# Altium schematic sheet BOC_KB.SchDoc: Board-On-Chip Keyboard
size A; Organization: Altium Limited; Address1: L3, 12a Rodborough Rd; Address2: Frenchs Forest; Address3: NSW; Address4: Australia 2086; Revision: 1.06; SheetNumber: 6; SheetTotal: 16
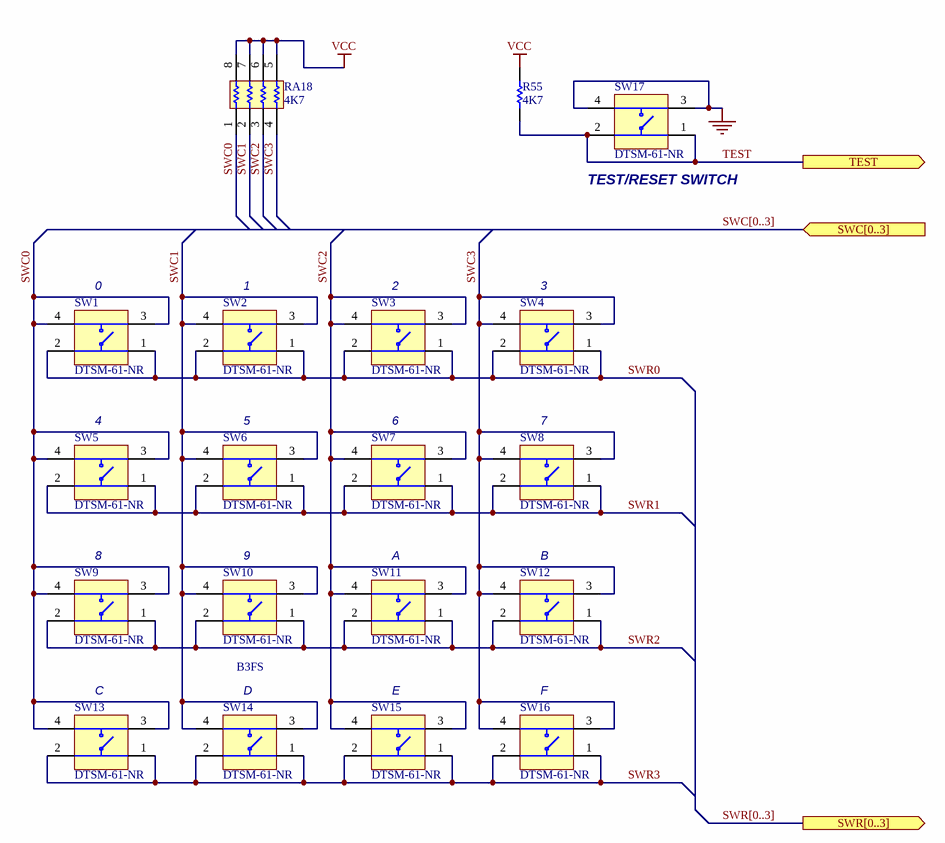
[diagram p0: BOC_KB.SchDoc]

## Parts
R55  4K7  [CC2012-0805]
RA18  4K7  [MNR34]
SW1  DTSM-61-NR  [B3FS_SWITCH]
SW2  DTSM-61-NR  [B3FS_SWITCH]
SW3  DTSM-61-NR  [B3FS_SWITCH]
SW4  DTSM-61-NR  [B3FS_SWITCH]
SW5  DTSM-61-NR  [B3FS_SWITCH]
SW6  DTSM-61-NR  [B3FS_SWITCH]
SW7  DTSM-61-NR  [B3FS_SWITCH]
SW8  DTSM-61-NR  [B3FS_SWITCH]
SW9  DTSM-61-NR  [B3FS_SWITCH]
SW10  DTSM-61-NR  [B3FS_SWITCH]
SW11  DTSM-61-NR  [B3FS_SWITCH]
SW12  DTSM-61-NR  [B3FS_SWITCH]
SW13  DTSM-61-NR  [B3FS_SWITCH]
SW14  DTSM-61-NR  [B3FS_SWITCH]
SW15  DTSM-61-NR  [B3FS_SWITCH]
SW16  DTSM-61-NR  [B3FS_SWITCH]
SW17  DTSM-61-NR  [B3FS_SWITCH]

## Ports
SWC[0..3] (in), SWR[0..3] (out), TEST (out)

## Nets
GND: SW17.3 SW17.4
VCC: R55.1 RA18.5 RA18.6 RA18.7 RA18.8
SWC0: RA18.1 SW1.3 SW1.4 SW5.3 SW5.4 SW9.3 SW9.4 SW13.3 SW13.4
SWC1: RA18.2 SW2.3 SW2.4 SW6.3 SW6.4 SW10.3 SW10.4 SW14.3 SW14.4
SWC2: RA18.3 SW3.3 SW3.4 SW7.3 SW7.4 SW11.3 SW11.4 SW15.3 SW15.4
SWC3: RA18.4 SW4.3 SW4.4 SW8.3 SW8.4 SW12.3 SW12.4 SW16.3 SW16.4
SWR0: SW1.1 SW1.2 SW2.1 SW2.2 SW3.1 SW3.2 SW4.1 SW4.2
SWR1: SW5.1 SW5.2 SW6.1 SW6.2 SW7.1 SW7.2 SW8.1 SW8.2
SWR2: SW9.1 SW9.2 SW10.1 SW10.2 SW11.1 SW11.2 SW12.1 SW12.2
SWR3: SW13.1 SW13.2 SW14.1 SW14.2 SW15.1 SW15.2 SW16.1 SW16.2
TEST: R55.2 SW17.1 SW17.2 ; port TEST

## Buses and harness runs
bus SWC[0..3] = port SWC[0..3]
bus SWR[0..3] = port SWR[0..3]

## Notes on the sheet
- (near SW17) TEST/RESET SWITCH
- (near SW1) 0
- (near SW2) 1
- (near SW3) 2
- (near SW4) 3
- (near SW5) 4
- (near SW6) 5
- (near SW7) 6
- (near SW8) 7
- (near SW9) 8
- (near SW10) 9
- (near SW11) A
- (near SW12) B
- (near SW13) C
- (near SW14) D
- (near SW15) E
- (near SW16) F
- Title
- Size:
- Date:
- Number:
- Time:
- Revision:
- Sheet
- of
- File:

## Library data of the parts
R55 = RES: Resistor; Fitted: True
RA18 = MNR34: 3216x4 Resistor Array; Fitted: True
SW1-SW17 = B3FS: SPNA SMD Keyboard Switch; Fitted: True
  SW1 SW10: Comment_1: B3FS